# EAGLE design voltageRegulator (EAGLE 9.4.2)
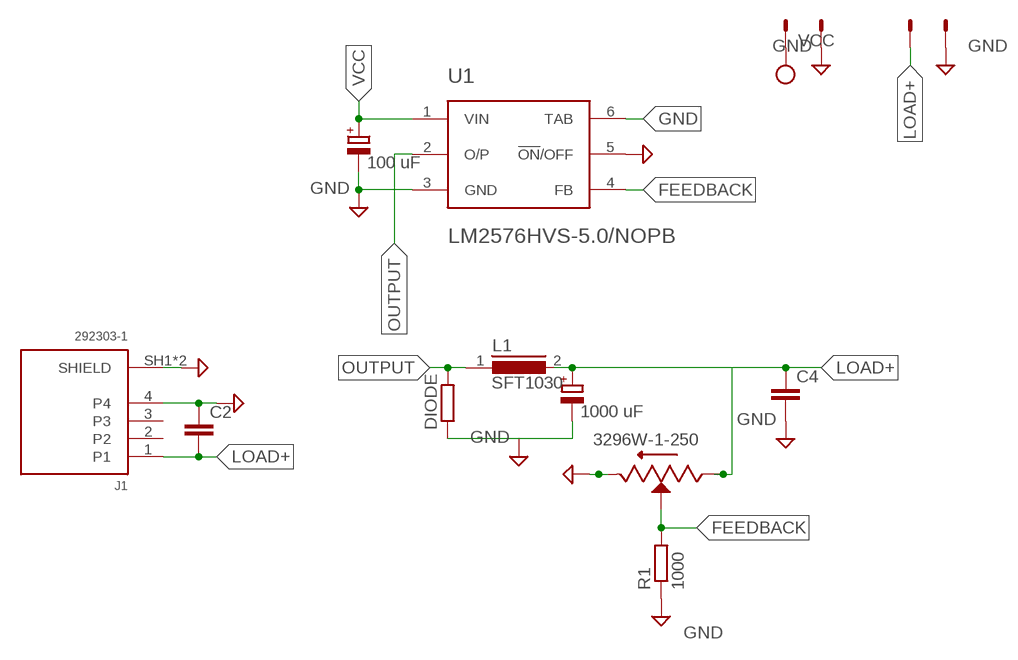
[diagram p0: schematic, sheet 1]

## Parts
C1  100 uF  CPOL-EUE5-13  [E5-13]
C2  C-EUC1206K  [C1206K]
C3  1000 uF  CPOL-EUE7.5-16  [E7,5-16]
C4  C-EUC1206K  [C1206K]
DIODE  3000  R-EU_R1206  [R1206]
INPUT  22-23-2021  [22-23-2021]
J1  292303-1  [TE_292303-1]
L1  SFT1030  [SFT1030]
OUTPUT  22-23-2021  [22-23-2021]
R1  1000  R-EU_R1206  [R1206]
U1  LM2576HVS-5.0/NOPB  [DDPAK/TO-263-5]
VR1  3296W-1-250  [TRIM_3296W-1-250]

## Nets
FEEDBACK: R1.2 U1.4(FB) VR1.2(WIPER)
GND: C1.- C2.1 C3.- C4.2 DIODE.1 INPUT.2 J1.4 J1.SH1(SHIELD) J1.SH2(SHIELD) OUTPUT.2 R1.1 U1.3(GND) U1.5(!ON!/OFF) U1.6(TAB) VR1.3(CW)
LOAD+: C2.2 C3.+ C4.1 J1.1 L1.2 OUTPUT.1 VR1.1(CCW)
OUTPUT: DIODE.2 L1.1 U1.2(O/P)
VCC: C1.+ INPUT.1 U1.1(VIN)
Unconnected: J1.2 J1.3

## Library data of the parts
C1 C3 = rcl:CPOL-EU: POLARIZED CAPACITOR, European symbol; SPICEPREFIX: C
C2 C4 = rcl:C-EU: CAPACITOR, European symbol; SPICEPREFIX: C
DIODE R1 = rcl:R-EU_: RESISTOR, European symbol; SPICEPREFIX: R
INPUT OUTPUT = con-molex:22-23-2021: .100" (2.54mm) Center Header - 2 Pin; MF: MOLEX; MPN: 22-23-2021; OC_FARNELL: 1462926; OC_NEWARK: 25C3832
J1 = 292303-1:292303-1: CONN USB RECEPT R/A TYPE A 4POS; CURRENT_RATING: 1A; FINISH: Gold or Gold-Palladium; GENDER: FEMALE; LATEST_REVISION_DATE: 20JUL17; LATEST_REVISION_NOTE: REVISED PER ECR-17-010413; MANUFACTURER: TE Connectivity; MANUFACTURERLINK: http://www.te.com/commerce/DocumentDelivery/DDEController?Action=srchrtrv&DocNm=292303&DocType=Customer+Drawing&DocLang=English; ORIENTATION: R/A; PART_DESCRIPTION: CONN USB RECEPT R/A TYPE A 4POS; PART_REVISION: E12; POSITIONS: 4; ROHS_COMPLIANT: YES; STANDARD: MANUFACTURER RECOMMENDATIONS; TYPE: USB; VOLTAGE_RATING_AC: 30
L1 = inductors:SFT1030: INDUCTOR; SPICEPREFIX: L
U1 = IC:LM2576HVS-5.0/NOPB: IC REG BUCK 5V 3A TO263-5 Manufacturer's datasheet <http://www.ti.com/general/docs/suppproductinfo.tsp?distId=10&gotoUrl=http%3A%2F%2Fwww.ti.com%2Flit%2Fgpn%2Flm2576hv>; CREATED_BY: PCBLayout.com; DIGIKEY_PART_NUMBER: LM2576HVS-5.0/NOPB-ND; MANUFACTURER: LM2576HVS-5.0/NOPB; MPN: LM2576HVS-5.0/NOPB; PACKAGE: DDPAK/TO-263-5
VR1 = 3296W-1-250:3296W-1-250: Res Cermet Trimmer 500K Ohm 10% 0.5W 25(Elec)Turn 2.19mm (9.53 X 4.83 X 11.55mm) Pin Thru-Hole Tube Check prices <https://pricing.snapeda.com/search/part/3296W-1-250/?ref=eda>; AVAILABILITY: Bad; DESCRIPTION: 25 Ohms 0.5W, 1/2W PC Pins Through Hole Trimmer Potentiometer Cermet 25 Turn Top Adjustment; MF: Bourns; MP: 3296W-1-250; PACKAGE: SOT-23-5 Bourns; PRICE: None

## Board
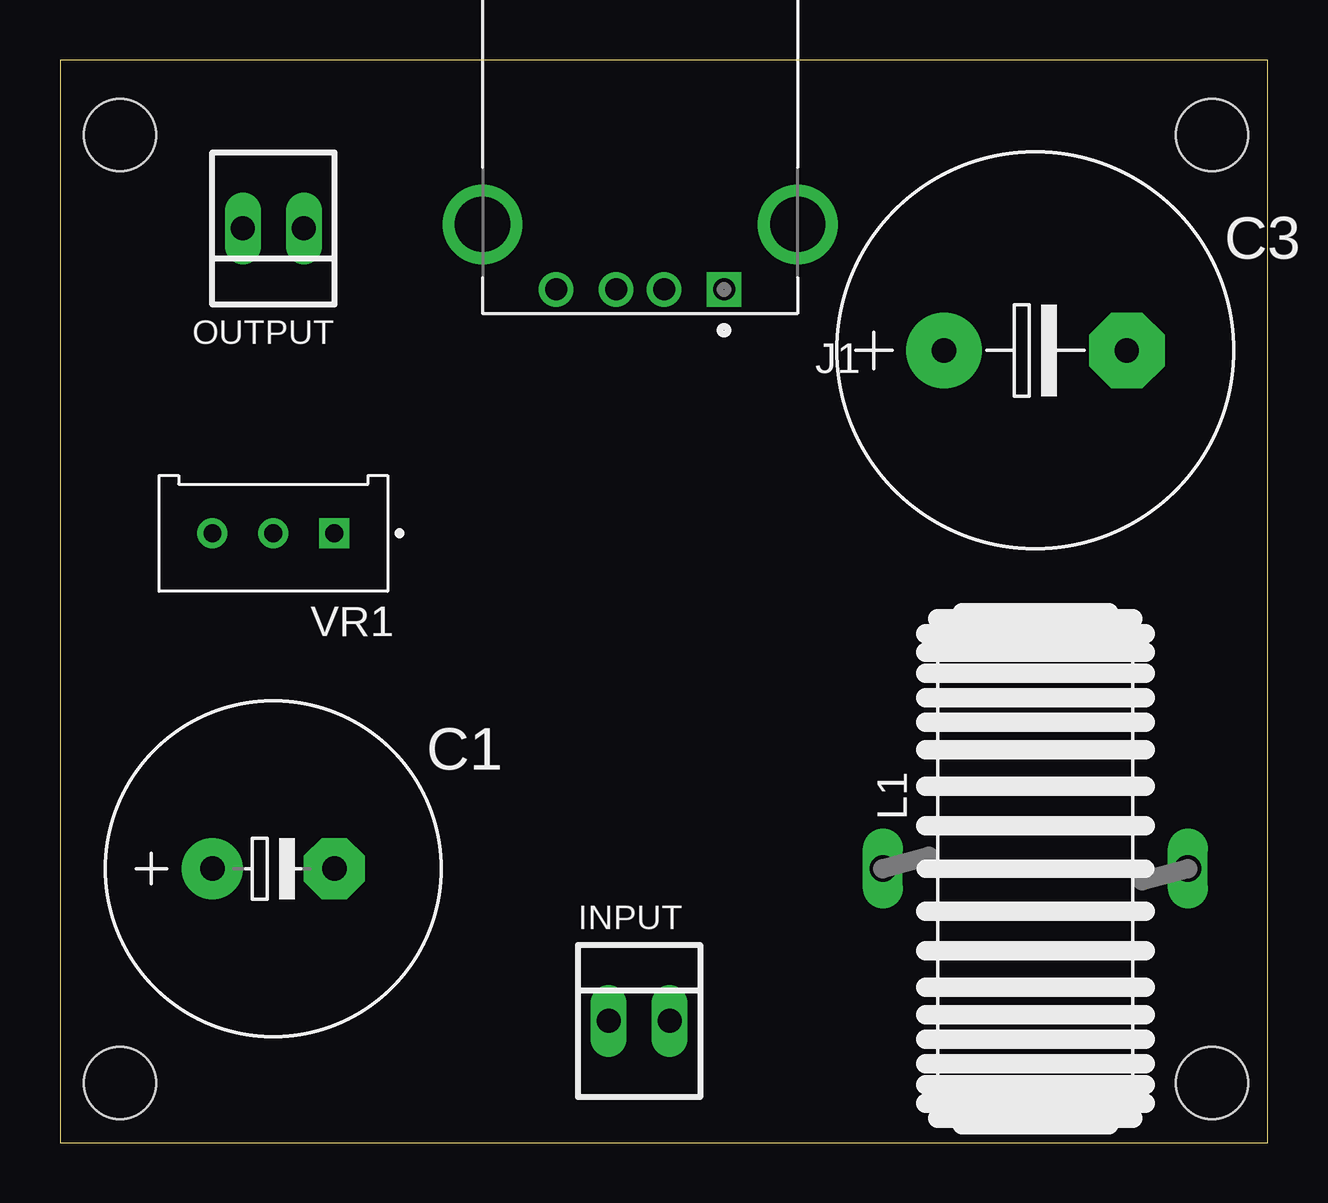
[diagram p1: board, top side]
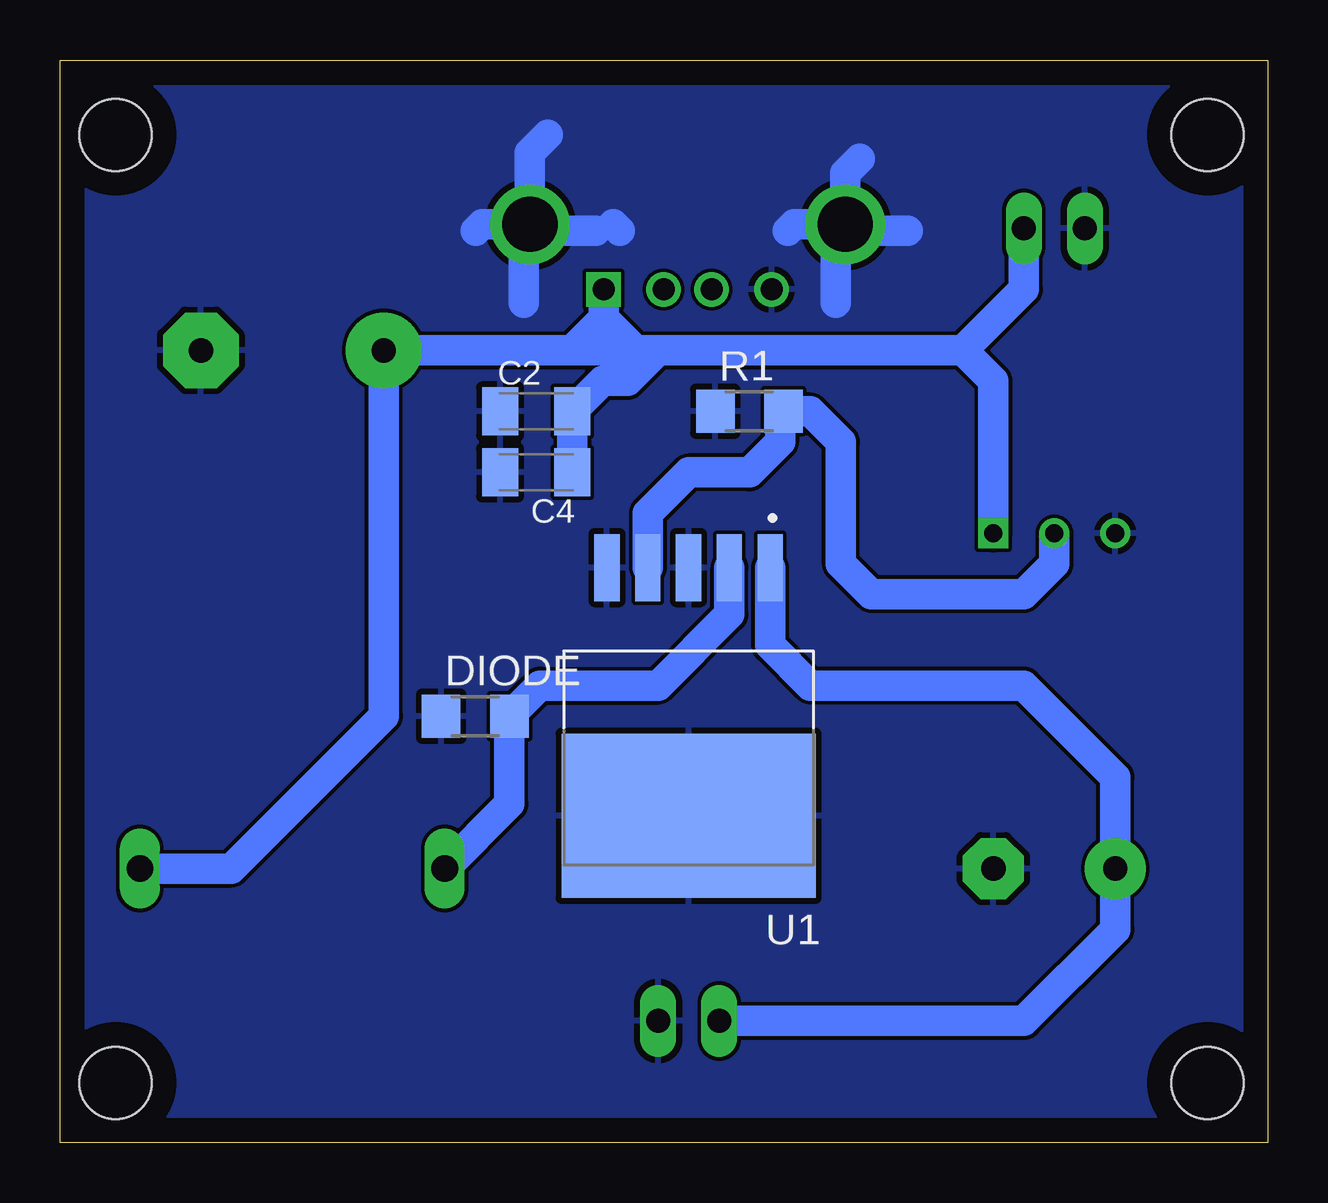
[diagram p2: board, bottom side, seen from below]

Size 50.32 x 45.12 mm. Coordinates in mm from the lower left corner, seen from the top.
Outline: 0,0 50.32,0 50.32,45.12 0,45.12 0,0
Copper layers (1*16): Top 0.035mm / dielectric 1.5mm / Bottom 0.035mm
Design rules "default": minimum track width 6mil, minimum drill 0.35mm, track to track 6mil, track to pad 6mil, pad to pad 6mil, via to via 6mil, smd to smd 6mil, copper to edge 40mil, drill to drill 6mil, minimum pad ring 10mil, minimum via ring 8mil, stop-mask expansion 4mil, vias tented up to drill 0mil, thermal gap 10mil
Holes 3 mm at 2.5,42 48,42 48,2.5 2.5,2.5

### Footprints (pad centres in the part's own frame; a part is rotated, then mirrored left to right if it is on the bottom)
E5-13 = drill 1.016 pad 2.54: + -2.54,0 | drill 1.016 pad 2.54 octagon: - 2.54,0
C1206K = smd 1.5 x 2: 1 -1.5,0; 2 1.5,0
E7,5-16 = drill 1.016 pad 3.15: + -3.81,0 | drill 1.016 pad 3.15 octagon: - 3.81,0
R1206 = smd 1.6 x 1.803: 1 -1.422,0; 2 1.422,0
22-23-2021 = drill 1 long: 1 -1.27,0; 2 1.27,0
TE_292303-1 = drill 0.92 square: 1 0,0 | drill 0.92: 2 2.5,0; 3 4.5,0; 4 7,0 | drill 2.3: SH1 -3.07,-2.71; SH2 10.07,-2.71
SFT1030 = drill 1.118 long: 1 -6.35,0; 2 6.35,0
DDPAK/TO-263-5 = smd 1.05 x 2.79: 1 -3.4,-6.19; 2 -1.7,-6.19; 3 0,-6.19; 4 1.7,-6.19; 5 3.4,-6.19 | smd 10.58 x 6.84: 6 0,4.15
TRIM_3296W-1-250 = drill 0.74 square: 1 -2.54,0 | drill 0.74: 2 0,0; 3 2.54,0

### Placement (x,y rotation side)
C1  8.89,11.43 0 top
C2  30.48,30.48 0 bottom
C3  40.64,33.02 0 top
C4  30.48,27.94 180 bottom
DIODE  33.02,17.78 0 bottom
INPUT  24.13,5.08 0 top
J1  27.67,35.56 180 top
L1  40.64,11.43 0 top
OUTPUT  8.89,38.1 180 top
R1  21.59,30.48 0 bottom
U1  24.13,17.78 180 bottom
VR1  8.89,25.4 180 top

### Tracks (layer width: path | path; a pad name or v marks a point on that pad's centre or on a via)
FEEDBACK
  Bottom 1.27: U1.4 25.83,26.24 24.13,27.94 21.59,27.94 20.32,29.21 20.32,30.33 R1.2 19.05,30.48 17.78,29.21 17.78,24.13 16.51,22.86 10.16,22.86 8.89,24.13 VR1.2
GND
  Bottom 1.27: 27.27,38.27 27,38 | J1.SH2 19.73,38.27 20,38 | J1.SH2 17.33,38 15,38 | J1.SH2 18,37.87 18,35 | J1.SH2 17.6,40.4 17,41 | J1.SH1 31,38.01 31,35 | J1.SH1 30.74,41.26 30,42 | J1.SH1 32.73,38.27 33,38 | J1.SH1 30.47,38 28,38
  pour Bottom: 41.91,-19.05 -2.54,-19.05 -11.43,-10.16 -11.43,102.87 165.1,102.87 165.1,-19.05 166.37,-20.32 43.18,-20.32
LOAD+
  Bottom 1.27: 27.67,35.29 J1.1 27.67,34.35 | 25.4,33.02 12.7,33.02 | 12.7,33.02 10.16,35.56 OUTPUT.1 | C4.1 C2.2 27.71,31.75 26.67,31.75 25.4,33.02 | L1.2 43.18,11.43 36.83,17.78 C3.+ 29,33.02 | 12.7,33.02 11.43,31.75 VR1.1 | 29,33.02 27,33.02 | 27,33.02 26.34,33.02 | 27.67,34.35 29,33.02 | 27.67,34.35 27.67,33.69 27,33.02 | 27.67,34.35 26.34,33.02 | 26.34,33.02 25.4,33.02
OUTPUT
  Bottom 1.27: L1.1 31.6,14.12 DIODE.2 30.33,19.05 25.4,19.05 22.43,22.02 U1.2
VCC
  Bottom 1.27: INPUT.1 10.16,5.08 6.35,8.89 C1.+ 6.35,15.24 10.16,19.05 19.05,19.05 20.73,20.73 U1.1